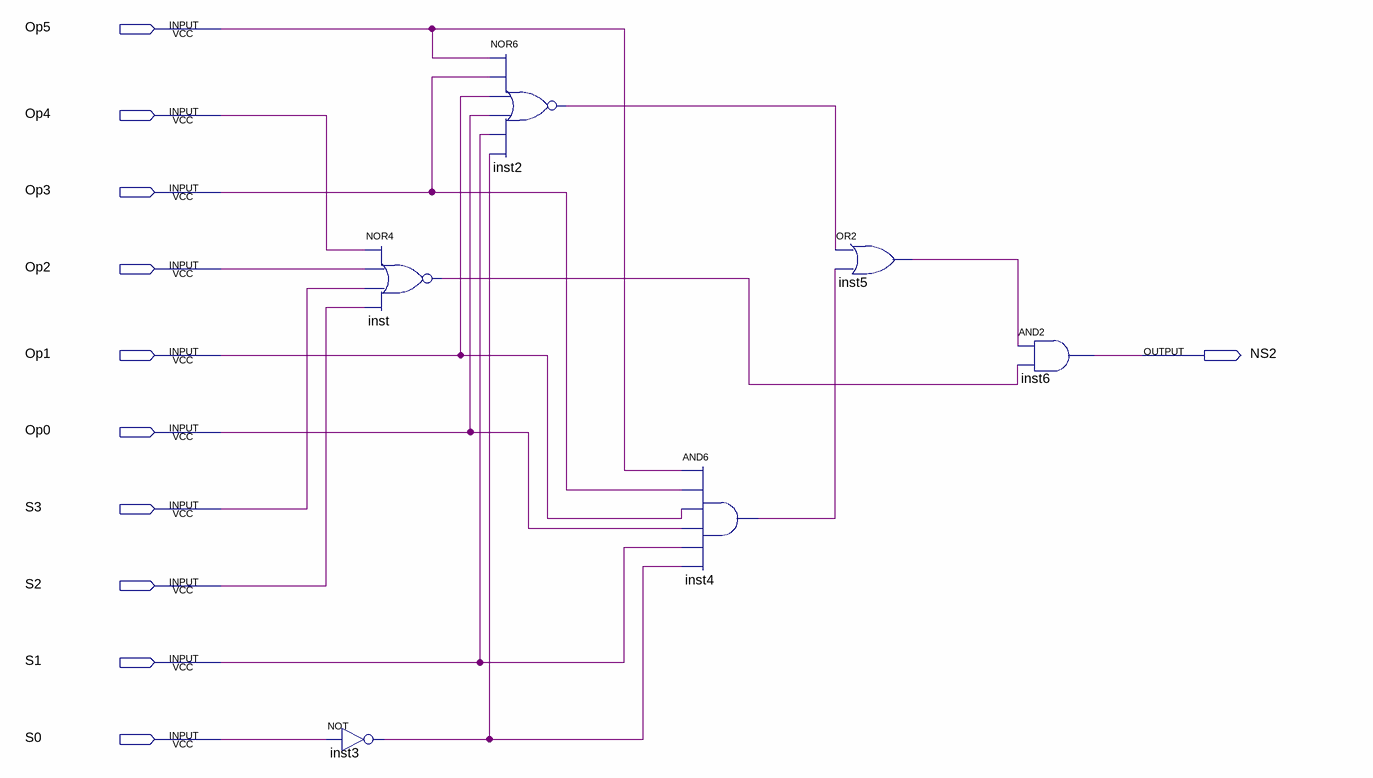
[diagram p0: schematic sheet]
// Quartus schematic NS2.bdf as structural Verilog: 6 symbols, 11 pins
module NS2 (
  input  Op5,
  input  Op4,
  input  Op3,
  input  Op2,
  input  Op1,
  input  Op0,
  input  S3,
  input  S2,
  input  S1,
  input  S0,
  output NS2
);

  wire inst2_out, inst3_out, inst4_out, inst5_out, inst_out;

  nor inst (inst_out, Op4, Op2, S3, S2);
  not inst3 (inst3_out, S0);
  nor inst2 (inst2_out, Op5, Op3, Op1, Op0, S1, inst3_out);
  and inst4 (inst4_out, Op5, Op3, Op1, Op0, S1, inst3_out);
  or inst5 (inst5_out, inst2_out, inst4_out);
  and inst6 (NS2, inst5_out, inst_out);
endmodule
